# EAGLE design H-Bridge (EAGLE 4.16)
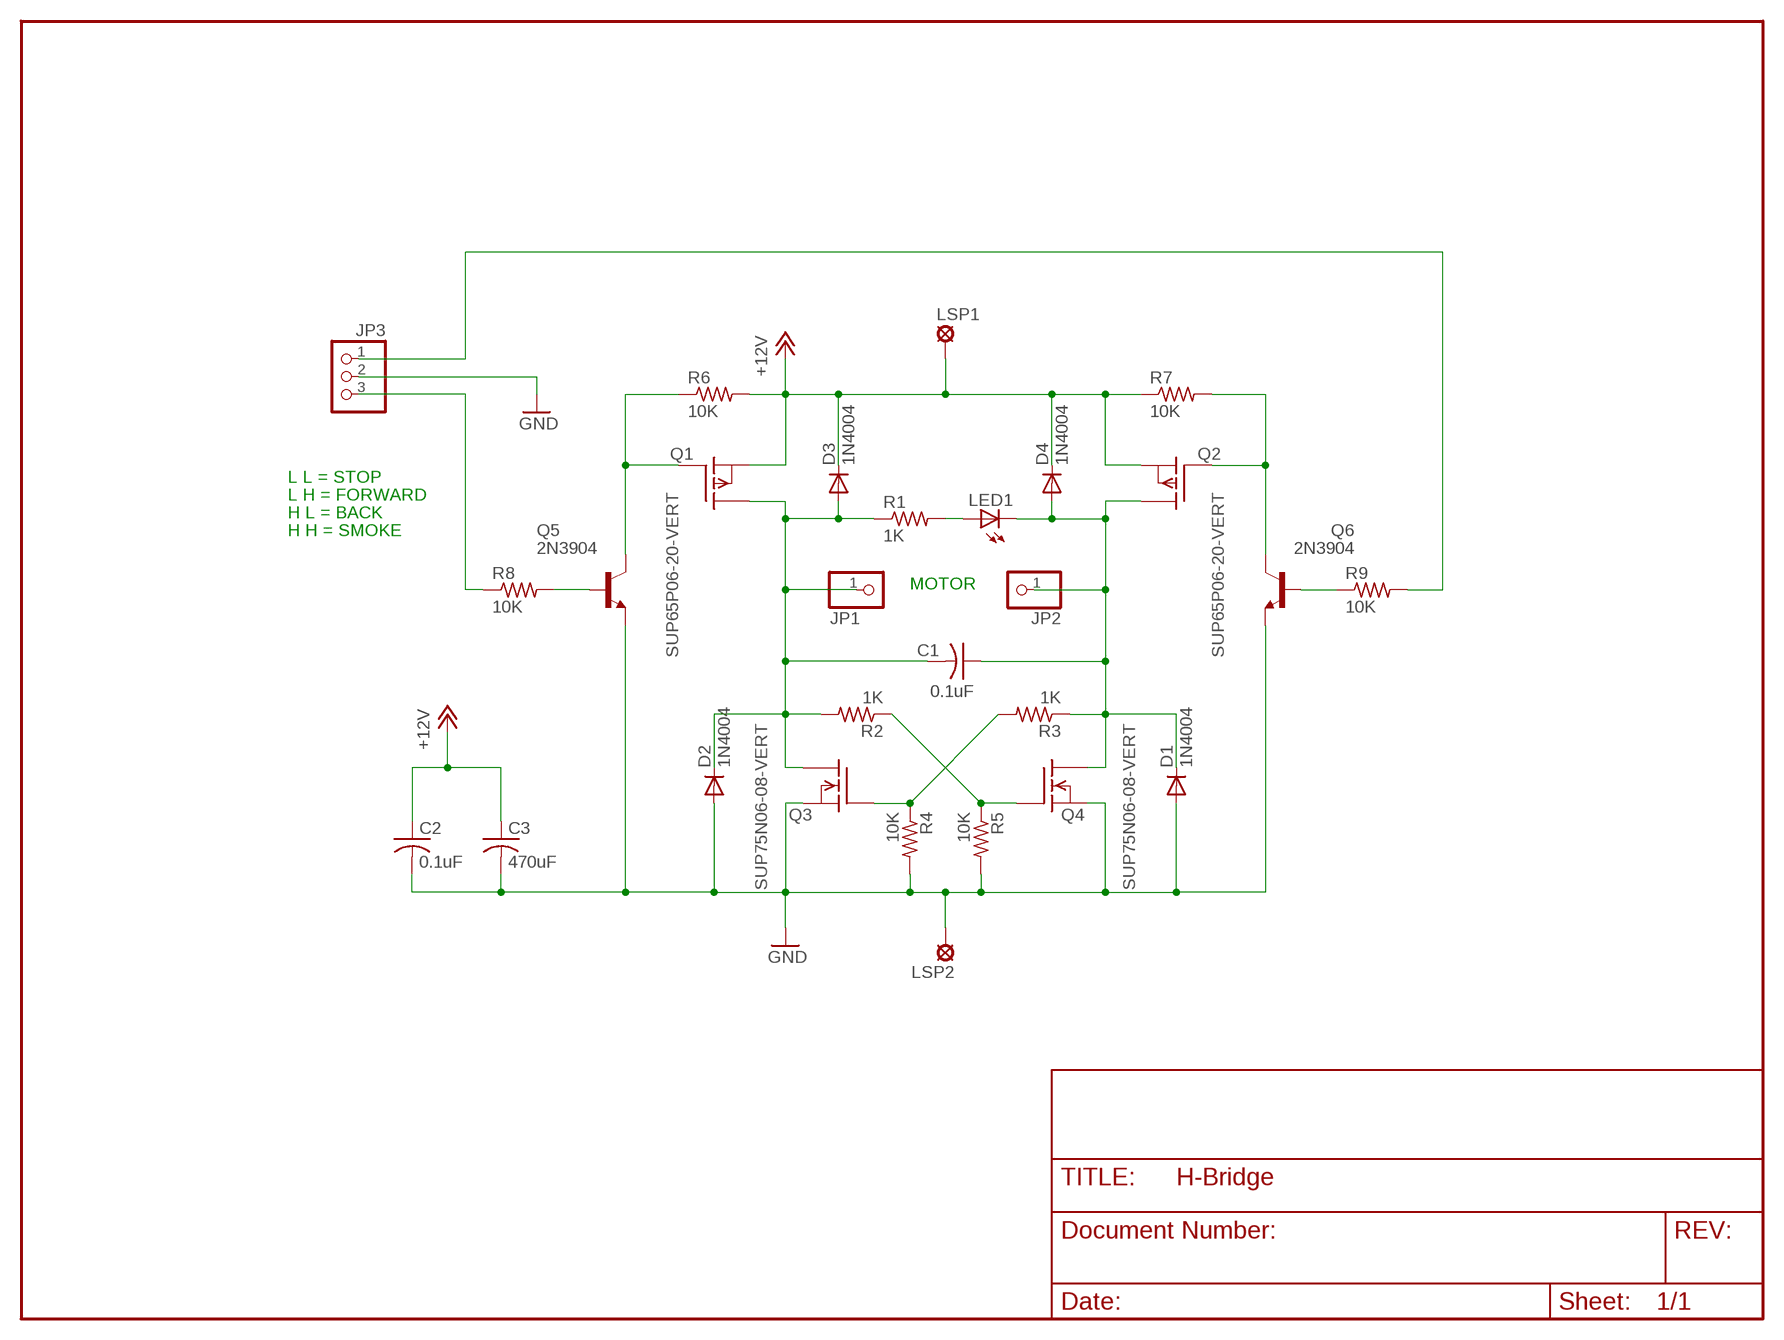
[diagram p0: schematic, sheet 1]

## Parts
C1  0.1uF  C-US075-032X103  [C075-032X103]
C2  0.1uF  C-US075-032X103  [C075-032X103]
C3  470uF  C-US075-032X103  [C075-032X103]
D1  1N4004  [DO41-10]
D2  1N4004  [DO41-10]
D3  1N4004  [DO41-10]
D4  1N4004  [DO41-10]
JP1  PINHD-1X1  [1X01]
JP2  PINHD-1X1  [1X01]
JP3  PINHD-1X3  [1X03]
LED1  LED3MM  [LED3MM]
LSP1  SE14  [SE14]
LSP2  SE14  [SE14]
Q1  SUP65P06-20-VERT  [TO220V]
Q2  SUP65P06-20-VERT  [TO220V]
Q3  SUP75N06-08-VERT  [TO220V]
Q4  SUP75N06-08-VERT  [TO220V]
Q5  2N3904  [TO92]
Q6  2N3904  [TO92]
R1  1K  R-US_0309/10  [0309/10]
R2  1K  R-US_0309/10  [0309/10]
R3  1K  R-US_0309/10  [0309/10]
R4  10K  R-US_0309/10  [0309/10]
R5  10K  R-US_0309/10  [0309/10]
R6  10K  R-US_0309/10  [0309/10]
R7  10K  R-US_0309/10  [0309/10]
R8  10K  R-US_0309/10  [0309/10]
R9  10K  R-US_0309/10  [0309/10]

## Nets
+12V: C2.1 C3.1 D3.C D4.C LSP1.MP Q1.3(S) Q2.3(S) R6.2 R7.1
GND: C2.2 C3.2 D1.A D2.A JP3.2 LSP2.MP Q3.3(S) Q4.3(S) Q5.3(E) Q6.3(E) R4.2 R5.2
N$1: C1.2 D2.C D3.A JP1.1 Q1.2(D) Q3.2(D) R1.1 R2.2
N$2: C1.1 D1.C D4.A JP2.1 LED1.K(C) Q2.2(D) Q4.2(D) R3.1
N$4: Q3.1(G) R3.2 R4.1
N$5: LED1.A R1.2
N$6: Q4.1(G) R2.1 R5.1
N$8: Q1.1(G) Q5.1(C) R6.1
N$10: Q2.1(G) Q6.1(C) R7.2
N$11: Q5.2(B) R8.2
N$12: Q6.2(B) R9.1
N$13: JP3.3 R8.1
N$14: JP3.1 R9.2

## Notes on the sheet
- L L = STOP
- L H = FORWARD
- H L = BACK
- H H = SMOKE
- MOTOR

## Library data of the parts
C1-C3 = rcl:C-US: CAPACITOR, American symbol
D1-D4 = diode:1N4004: DIODE general purpose rectifier, 1 A
JP1 JP2 = pinhead:PINHD-1X1: PIN HEADER
JP3 = pinhead:PINHD-1X3: PIN HEADER
LED1 = led:LED: LED OSRAM: - CHIPLED LG R971, LG N971, LY N971, LG Q971, LY Q971, LO R971, LY R971 LH N974, LH R974 LS Q976, LO Q976, LY Q976 LO Q996 - Hyper CHIPLED LW Q18S LB Q993, LB Q99A, LB R99A - SideLED LS A670, LO A670, LY A670, LG A670, LP A670 LB A673, LV A673, LT A673, LW A673 LH A674 LY A675 LS A676, LA A676, LO A676, LY A676, LW A676 LS A679, LY A679, LG A679 - Hyper Micro SIDELED® LS Y876, LA Y876, LO Y876, LY Y876 LT Y87S - SmartLED LW L88C, LW L88S LB L89C, LB L89S, LG L890 LS L89K, LO L89K, LY L89K LS L896, LA L896, LO L896, LY L896 - TOPLED LS T670, LO T670, LY T670, LG T670, LP T670 LSG T670, LSP T670, LSY T670, LOP T670, LYG T670 LG T671, LOG T671, LSG T671 LB T673, LV T673, LT T673, LW T673 LH T674 LS T676, LA T676, LO T676, LY T676, LB T676, LH T676, LSB T676, LW T676 LB T67C, LV T67C, LT T67C, LS T67K, LO T67K, LY T67K, LW E67C LS E67B, LA E67B, LO E67B, LY E67B, LB E67C, LV E67C, LT E67C LW T67C LS T679, LY T679, LG T679 LS T770, LO T770, LY T770, LG T770, LP T770 LB T773, LV T773, LT T773, LW T773 LH T774 LS E675, LA E675, LY E675, LS T675 LS T776, LA T776, LO T776, LY T776, LB T776 LHGB T686 LT T68C, LB T68C - Hyper Mini TOPLED® LB M676 - Mini TOPLED Santana® LG M470 LS M47K, LO M47K, LY M47K Source: http://www.osram.convergy.de - LUMILED® LXK2-PW12-R00, LXK2-PW12-S00, LXK2-PW14-U00, LXK2-PW14-V00 LXK2-PM12-R00, LXK2-PM12-S00, LXK2-PM14-U00 LXK2-PE12-Q00, LXK2-PE12-R00, LXK2-PE12-S00, LXK2-PE14-T00, LXK2-PE14-U00 LXK2-PB12-K00, LXK2-PB12-L00, LXK2-PB12-M00, LXK2-PB14-N00, LXK2-PB14-P00, LXK2-PB14-Q00 LXK2-PR12-L00, LXK2-PR12-M00, LXK2-PR14-Q00, LXK2-PR14-R00 LXK2-PD12-Q00, LXK2-PD12-R00, LXK2-PD12-S00 LXK2-PH12-R00, LXK2-PH12-S00 LXK2-PL12-P00, LXK2-PL12-Q00, LXK2-PL12-R00 Source: www.luxeon.com
LSP1 LSP2 = solpad:SE14: SOLDER PAD E1553, drill 1,4mm, distributor Buerklin, 07F820
Q1 Q2 = MyFETs:SUP65P06-20-VERT
Q3 Q4 = MyFETs:SUP75N06-08-VERT
Q5 Q6 = transistor-npn:2N3904: NPN Transistor
R1-R9 = rcl:R-US_: RESISTOR, American symbol

## Board
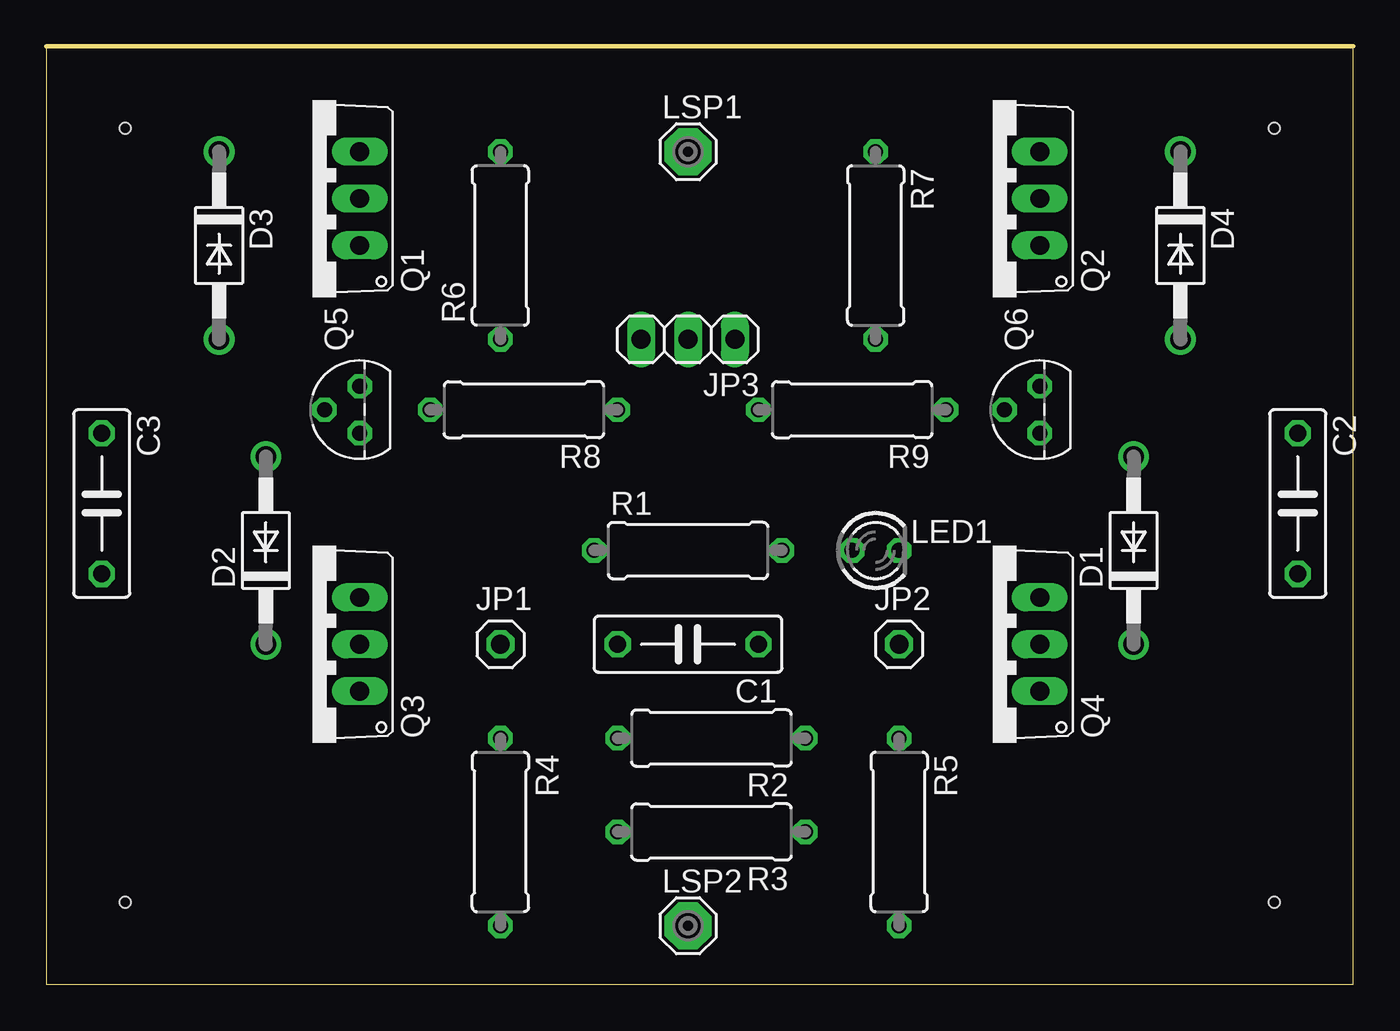
[diagram p1: board, top side]
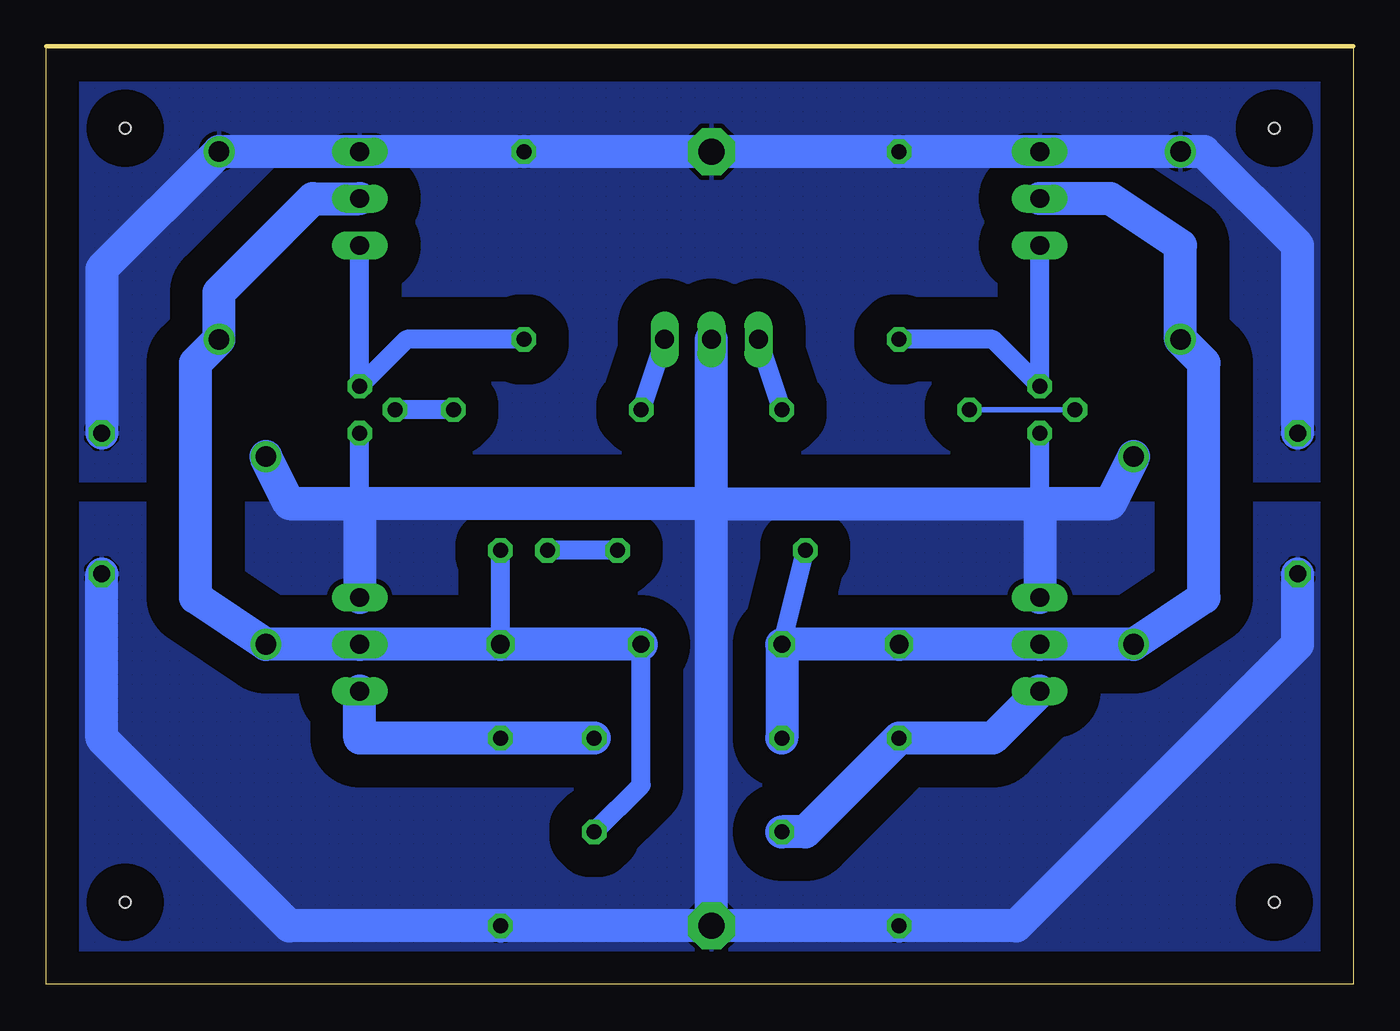
[diagram p2: board, bottom side, seen from below]

Size 70.79 x 50.79 mm. Coordinates in mm from the lower left corner, seen from the top.
Outline: 0,0 70.79,0 70.79,50.79 0,50.79 0,0
Copper layers (1*16): Top 0.035mm / dielectric 1.5mm / Bottom 0.035mm
Design rules "default": minimum track width 10mil, minimum drill 24mil, track to track 8mil, track to pad 8mil, pad to pad 8mil, via to via 8mil, smd to smd 8mil, copper to edge 40mil, drill to drill 8mil, minimum pad ring 10mil, minimum via ring 8mil, stop-mask expansion 4mil, vias tented up to drill 0mil, thermal gap 10mil
Holes 0.6 mm at 4.28,46.35 4.28,4.44 66.51,4.44 66.51,46.35

### Footprints (pad centres in the part's own frame; a part is rotated, then mirrored left to right if it is on the bottom)
C075-032X103 = drill 0.914 octagon: 1 -3.81,0; 2 3.81,0
DO41-10 = drill 1.118 round: A 5.08,0; C -5.08,0
1X01 = drill 1.016 octagon: 1 0,0
1X03 = drill 1.016 long: 1 -2.54,0; 2 0,0; 3 2.54,0
LED3MM = drill 0.813 octagon: A -1.27,0; K 1.27,0
SE14 = drill 1.397 pad 2.54 octagon: MP 0,0
TO220V = drill 1.016 long: 1 -2.54,-2.54; 2 0,-2.54; 3 2.54,-2.54
TO92 = drill 0.813 octagon: 1 1.27,0; 2 0,1.905; 3 -1.27,0
0309/10 = drill 0.813 octagon: 1 -5.08,0; 2 5.08,0

### Placement (x,y rotation side)
C1  34.76,18.41 180 top
C2  67.78,26.03 270 top
C3  3.01,26.03 270 top
D1  58.89,23.49 90 top
D2  11.9,23.49 90 top
D3  9.36,40 270 top
D4  61.43,40 270 top
JP1  24.6,18.41 0 top
JP2  46.19,18.41 0 top
JP3  34.76,34.92 180 top
LED1  44.92,23.49 0 top
LSP1  34.76,45.08 0 top
LSP2  34.76,3.17 0 top
Q1  14.44,42.54 90 top
Q2  51.27,42.54 90 top
Q3  14.44,18.41 90 top
Q4  51.27,18.41 90 top
Q5  16.98,31.11 90 top
Q6  53.81,31.11 90 top
R1  34.76,23.49 0 top
R2  36.03,13.33 180 top
R3  36.03,8.25 180 top
R4  24.6,8.25 270 top
R5  46.19,8.25 270 top
R6  24.6,40 90 top
R7  44.92,40 270 top
R8  25.87,31.11 180 top
R9  43.65,31.11 180 top

### Tracks (layer width: path | path; a pad name or v marks a point on that pad's centre or on a via)
+12V
  Bottom 1.778: C2.1 67.78,38.73 D4.C Q2.3 R7.1 LSP1.MP R6.2 Q1.3 D3.C 8.09,45.08 3.01,40 C3.1
  pour Bottom (isolate 1.778, hatched): -0.8,27.3 -0.8,52.7 74.13,52.7 74.13,27.3
GND
  Bottom 1.016: 16.98,26.03 Q5.3 | 53.81,26.03 Q6.3
  Bottom 1.778: LSP2.MP 34.76,26.03 | 34.76,26.03 JP3.2 | LSP2.MP R5.2 57.62,3.17 67.78,13.33 C2.2 | LSP2.MP R4.2 18.25,3.17 3.01,18.41 C3.2 | 13.17,26.03 16.98,26.03 Q3.3 | 57.62,26.03 53.81,26.03 Q4.3 | 13.17,26.03 D2.A | 34.76,26.03 13.17,26.03 | 57.62,26.03 D1.A | 34.76,26.03 57.62,26.03
  pour Bottom (isolate 1.778, hatched): -0.8,26.03 74.13,26.03 74.13,-0.64 -0.8,-0.64
N$1
  Bottom 1.016: C1.2 R1.1
  Bottom 1.778: Q1.2 13.17,42.54 9.36,40 D3.A 8.09,33.65 8.09,20.95 D2.C Q3.2 JP1.1 C1.2 R2.2
N$2
  Bottom 1.016: JP2.1 LED1.K | R3.1 38.57,10.79 C1.1
  Bottom 1.778: Q2.2 56.35,42.54 61.43,37.46 D4.A 62.7,33.65 62.7,20.95 D1.C Q4.2 JP2.1 C1.1
N$4
  Bottom 1.778: R3.2 29.68,8.25 R4.1 19.52,13.33 Q3.1
N$5
  Bottom 1.016: R1.2 LED1.A
N$6
  Bottom 1.778: Q4.1 53.81,13.33 R5.1 R2.1
N$8
  Bottom 1.016: Q1.1 Q5.1 19.52,34.92 R6.1
N$10
  Bottom 1.016: Q2.1 Q6.1 51.27,34.92 R7.2
N$11
  Bottom 0.305: Q5.2 R8.2
N$12
  Bottom 1.016: R9.1 Q6.2
N$13
  Bottom 1.016: R8.1 JP3.3
N$14
  Bottom 1.016: JP3.1 R9.2

### Text on the board
Dimension: REMEMBER: DO NOT MIRROR